# EAGLE design HW2schematic (EAGLE 8.1.0)
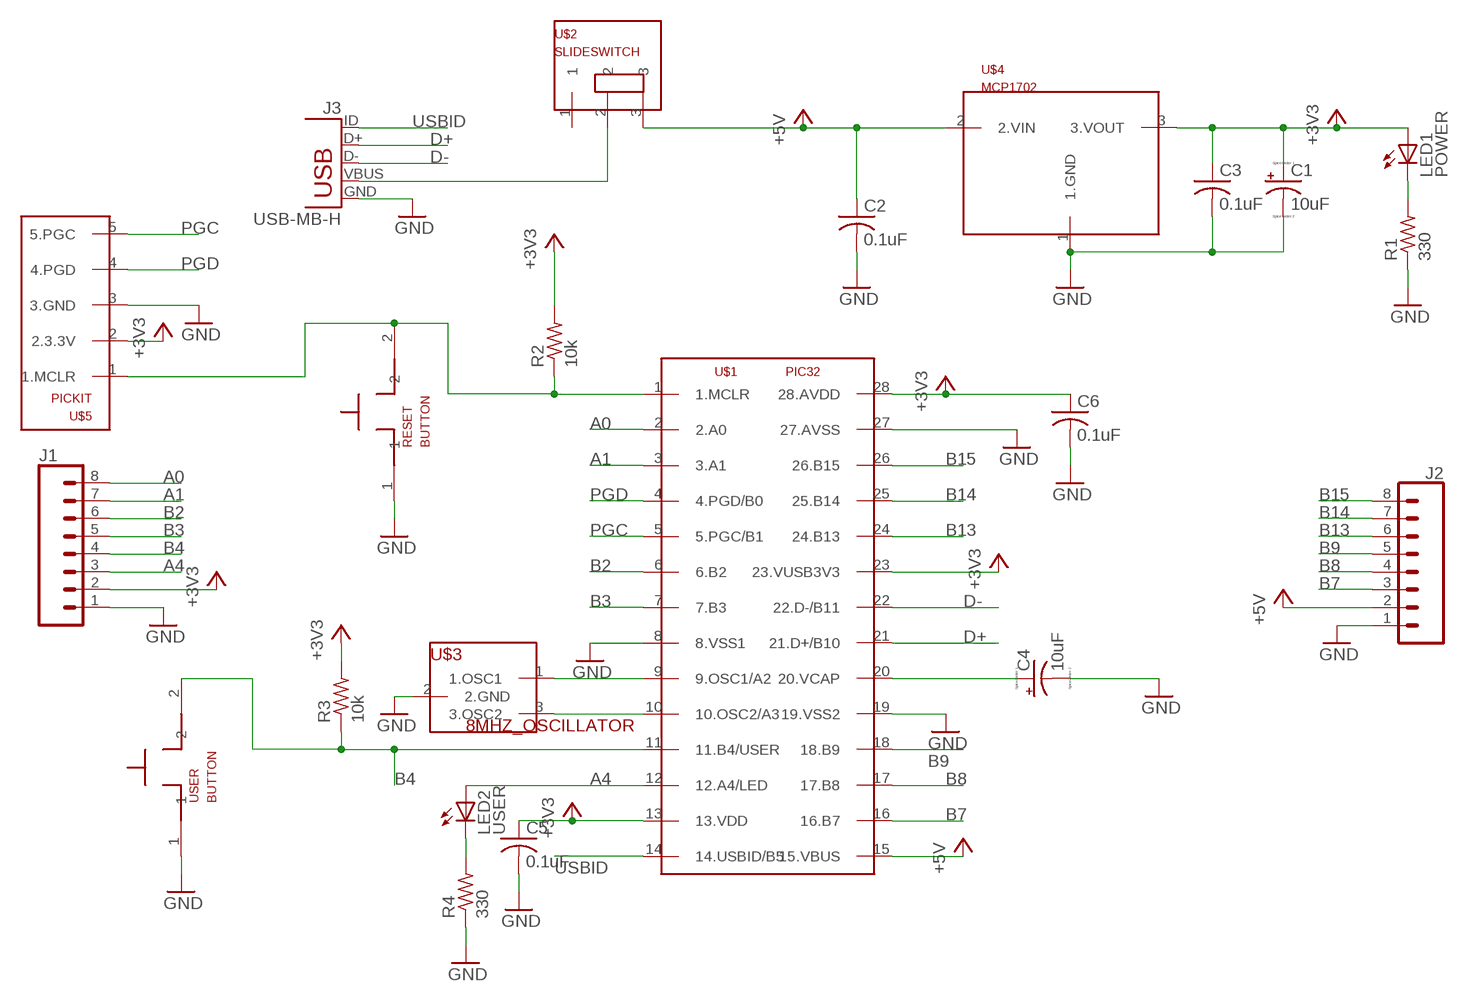
[diagram p0: schematic, sheet 1]

## Parts
C1  10uF  CPOL-USB45181B  [B45181B]
C2  0.1uF  C-US025-025X050  [C025-025X050]
C3  0.1uF  C-US025-025X050  [C025-025X050]
C4  10uF  CPOL-USB45181B  [B45181B]
C5  0.1uF  C-US025-025X050  [C025-025X050]
C6  0.1uF  C-US025-025X050  [C025-025X050]
J1  CONN_08  [1X08_NO_SILK]
J2  CONN_08  [1X08_NO_SILK]
J3  USB-MB-H  [USB-MB-H]
LED1  POWER  LED3MM  [LED3MM]
LED2  USER  LED3MM  [LED3MM]
R1  330  R-US_0207/10  [0207/10]
R2  10k  R-US_0207/10  [0207/10]
R3  10k  R-US_0207/10  [0207/10]
R4  330  R-US_0207/10  [0207/10]
RESET  BUTTON  [BUTTON]
U$1  PIC32  [DIL28-3]
U$2  SLIDESWITCH  [SLIDESWITCH]
U$3  8MHZ_OSCILLATOR  8MHZ_RESONATOR  [1X03]
U$4  MCP1702  [TO92]
U$5  PICKIT  [PICKIT]
USER  BUTTON  [BUTTON]

## Nets
+3V3: C1.+ C3.1 C5.1 C6.1 J1.2 LED1.A R2.2 R3.2 U$1.13(13.VDD) U$1.23(23.VUSB3V3) U$1.28(28.AVDD) U$4.3(3.VOUT) U$5.2(2.3.3V)
+5V: C2.1 J2.2 U$1.15(15.VBUS) U$2.3 U$4.2(2.VIN)
A0: J1.8 U$1.2(2.A0)
A1: J1.7 U$1.3(3.A1)
A4: J1.3 LED2.A U$1.12(12.A4/LED)
B2: J1.6 U$1.6(6.B2)
B3: J1.5 U$1.7(7.B3)
B4: J1.4 R3.1 U$1.11(11.B4/USER) USER.2
B7: J2.3 U$1.16(16.B7)
B8: J2.4 U$1.17(17.B8)
B9: J2.5 U$1.18(18.B9)
B13: J2.6 U$1.24(24.B13)
B14: J2.7 U$1.25(25.B14)
B15: J2.8 U$1.26(26.B15)
D+: J3.D+ U$1.21(21.D+/B10)
D-: J3.D- U$1.22(22.D-/B11)
GND: C1.- C2.2 C3.2 C4.- C5.2 C6.2 J1.1 J2.1 J3.GND R1.1 R4.1 RESET.1 U$1.8(8.VSS1) U$1.19(19.VSS2) U$1.27(27.AVSS) U$3.2(2.GND) U$4.1(1.GND) U$5.3(3.GND) USER.1
N$1: LED2.K(C) R4.2
N$4: R2.1 RESET.2 U$1.1(1.MCLR) U$5.1(1.MCLR)
N$5: C4.+ U$1.20(20.VCAP)
N$6: J3.VBUS U$2.2
N$7: U$1.9(9.OSC1/A2) U$3.1(1.OSC1)
N$8: LED1.K(C) R1.2
N$9: U$1.10(10.OSC2/A3) U$3.3(3.OSC2)
PGC: U$1.5(5.PGC/B1) U$5.5(5.PGC)
PGD: U$1.4(4.PGD/B0) U$5.4(4.PGD)
USBID: J3.ID(D+1) U$1.14(14.USBID/B5)
Unconnected: U$2.1

## Library data of the parts
C1 C4 = HW2library:CPOL-US: POLARIZED CAPACITOR, American symbol
C2 C3 C5 C6 = HW2library:C-US: CAPACITOR, American symbol
J1 J2 = HW2library:CONN_08: Multi connection point. Often used as Generic Header-pin footprint for 0.1 inch spaced/style header connections On any of the 0.1 inch spaced packages, you can populate with these: Break Away Headers - Straight <https://www.sparkfun.com/products/116> (PRT-00116) Break Away Male Headers - Right Angle <https://www.sparkfun.com/products/553> (PRT-00553) Female Headers <https://www.sparkfun.com/products/115> (PRT-00115) Break Away Headers - Machine Pin <https://www.sparkfun.com/products/117> (PRT-00117) Break Away Female Headers - Swiss Machine Pin <https://www.sparkfun.com/products/743> (PRT-00743) Arduino Stackable Header - 8 Pin <https://www.sparkfun.com/products/9279> (PRT-09279) For SCREWTERMINALS and SPRING TERMINALS visit here: Screw Terimnals on SparkFun.com <https://www.sparkfun.com/search/results?term=Screw+Terminals> (5mm/3.5mm/2.54mm spacing) This device is also useful as a general connection point to wire up your design to another part of your project. Our various solder wires solder well into these plated through hole pads. Hook-Up Wire - Assortment (Stranded, 22 AWG) <https://www.sparkfun.com/products/11375> (PRT-11375) Hook-Up Wire - Assortment (Solid Core, 22 AWG) <https://www.sparkfun.com/products/11367> (PRT-11367) View the entire wire category on our website here <https://www.sparkfun.com/categories/141> Special notes: Molex polarized connector foot print use with SKU : PRT-08231 with associated crimp pins and housings. 1MM SMD Version SKU: PRT-10208 NOTES ON THE VARIANTS LOCK and LOCK_LONGPADS... This footprint was designed to help hold the alignment of a through-hole component (i.e. 6-pin header) while soldering it into place. You may notice that each hole has been shifted either up or down by 0.005 of an inch from it's more standard position (which is a perfectly straight line). This slight alteration caused the pins (the squares in the middle) to touch the edges of the holes. Because they are alternating, it causes a "brace" to hold the component in place. 0.005 has proven to be the perfect amount of "off-center" position when using our standard breakaway headers. Although looks a little odd when you look at the bare footprint, once you have a header in there, the alteration is very hard to notice. Also,if you push a header all the way into place, it is covered up entirely on the bottom side.
J3 = HW2library:USB: USB Connectors USB-B-PTH is fully proven SKU : PRT-00139/CONN-08278 USB-miniB is fully proven SKU : PRT-00587 USB-A-PCB is untested. USB-A-H is throughly reviewed, but untested. Spark Fun Electronics SKU : PRT-00437 USB-B-SMT is throughly reviewed, but untested. Needs silkscreen touching up. USB-A-S has not been used/tested USB-MB-H has not been used/tested USB-MICROB has been used. CONN-09505
LED1 LED2 = HW2library:LED: LED OSRAM: - CHIPLED LG R971, LG N971, LY N971, LG Q971, LY Q971, LO R971, LY R971 LH N974, LH R974 LS Q976, LO Q976, LY Q976 LO Q996 - Hyper CHIPLED LW Q18S LB Q993, LB Q99A, LB R99A - SideLED LS A670, LO A670, LY A670, LG A670, LP A670 LB A673, LV A673, LT A673, LW A673 LH A674 LY A675 LS A676, LA A676, LO A676, LY A676, LW A676 LS A679, LY A679, LG A679 - Hyper Micro SIDELED® LS Y876, LA Y876, LO Y876, LY Y876 LT Y87S - SmartLED LW L88C, LW L88S LB L89C, LB L89S, LG L890 LS L89K, LO L89K, LY L89K LS L896, LA L896, LO L896, LY L896 - TOPLED LS T670, LO T670, LY T670, LG T670, LP T670 LSG T670, LSP T670, LSY T670, LOP T670, LYG T670 LG T671, LOG T671, LSG T671 LB T673, LV T673, LT T673, LW T673 LH T674 LS T676, LA T676, LO T676, LY T676, LB T676, LH T676, LSB T676, LW T676 LB T67C, LV T67C, LT T67C, LS T67K, LO T67K, LY T67K, LW E67C LS E67B, LA E67B, LO E67B, LY E67B, LB E67C, LV E67C, LT E67C LW T67C LS T679, LY T679, LG T679 LS T770, LO T770, LY T770, LG T770, LP T770 LB T773, LV T773, LT T773, LW T773 LH T774 LS E675, LA E675, LY E675, LS T675 LS T776, LA T776, LO T776, LY T776, LB T776 LHGB T686 LT T68C, LB T68C - Hyper Mini TOPLED® LB M676 - Mini TOPLED Santana® LG M470 LS M47K, LO M47K, LY M47K Source: http://www.osram.convergy.de LUXEON: - LUMILED® LXK2-PW12-R00, LXK2-PW12-S00, LXK2-PW14-U00, LXK2-PW14-V00 LXK2-PM12-R00, LXK2-PM12-S00, LXK2-PM14-U00 LXK2-PE12-Q00, LXK2-PE12-R00, LXK2-PE12-S00, LXK2-PE14-T00, LXK2-PE14-U00 LXK2-PB12-K00, LXK2-PB12-L00, LXK2-PB12-M00, LXK2-PB14-N00, LXK2-PB14-P00, LXK2-PB14-Q00 LXK2-PR12-L00, LXK2-PR12-M00, LXK2-PR14-Q00, LXK2-PR14-R00 LXK2-PD12-Q00, LXK2-PD12-R00, LXK2-PD12-S00 LXK2-PH12-R00, LXK2-PH12-S00 LXK2-PL12-P00, LXK2-PL12-Q00, LXK2-PL12-R00 Source: www.luxeon.com KINGBRIGHT: KA-3528ASYC Source: www.kingbright.com
R1-R4 = HW2library:R-US_: RESISTOR, American symbol
RESET USER = HW2library:BUTTON
U$1 = HW2library:PIC32
U$2 = HW2library:SLIDESWITCH
U$3 = HW2library:8MHZ_RESONATOR
U$4 = HW2library:MCP1702
U$5 = HW2library:PICKIT

## Board
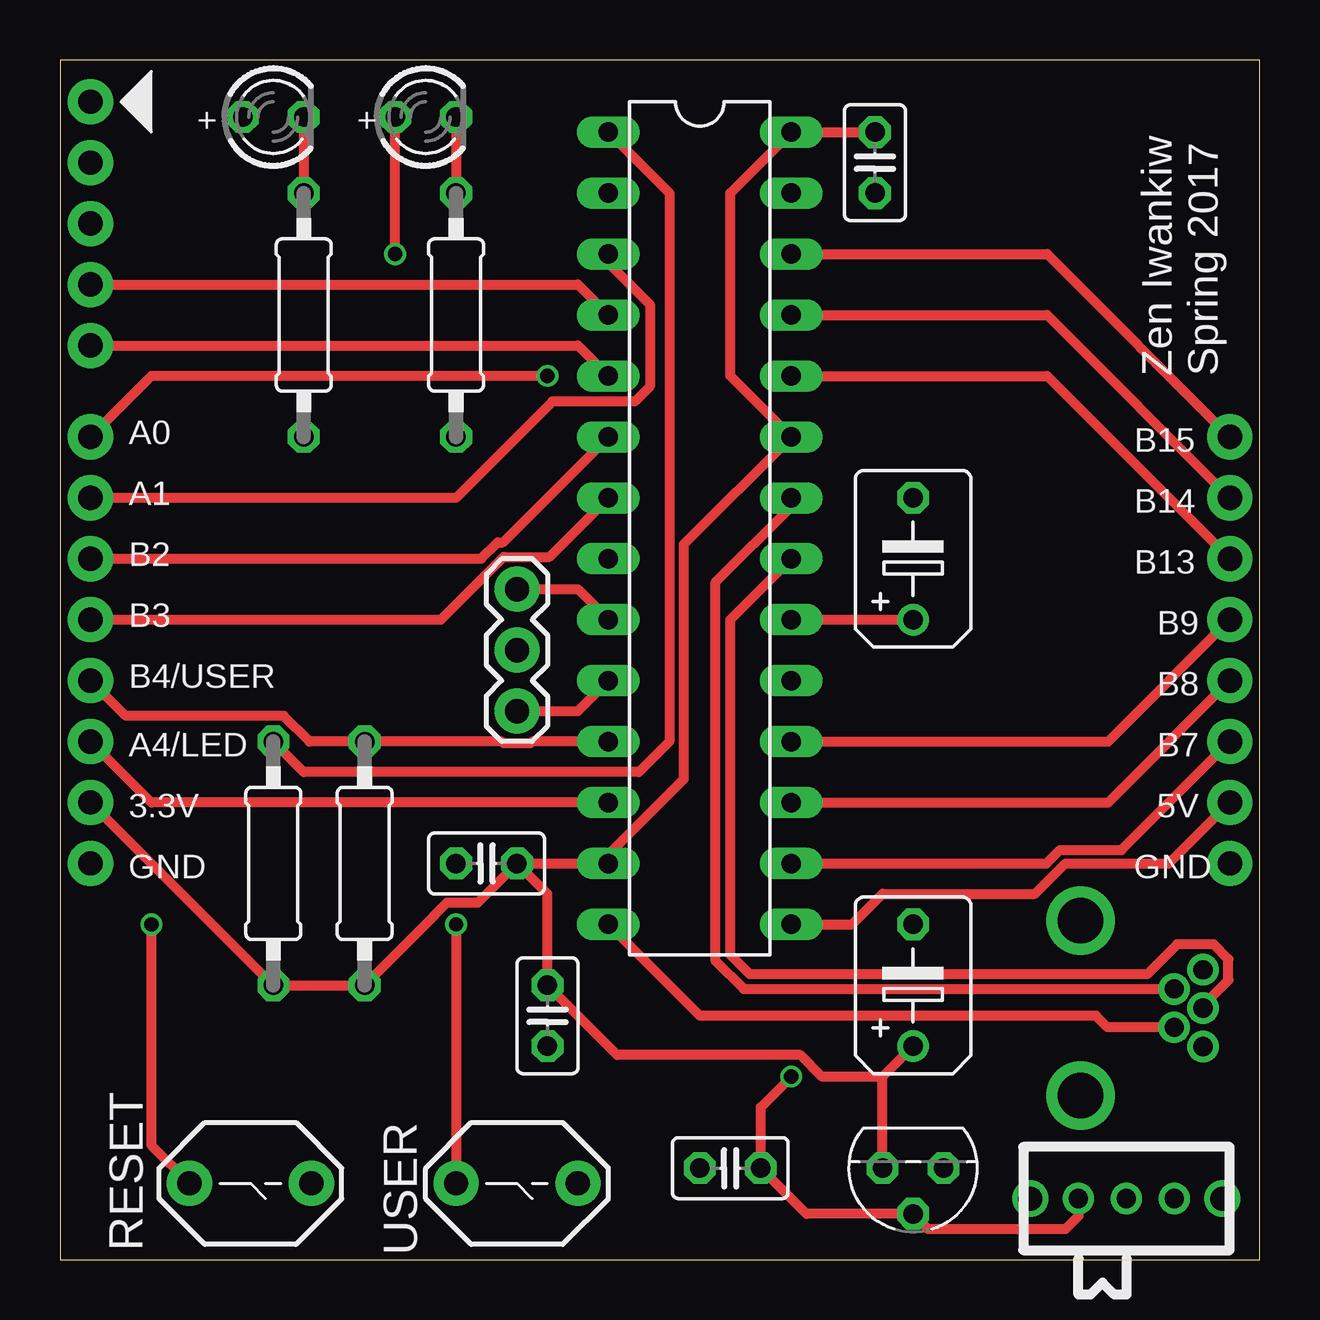
[diagram p1: board, top side]
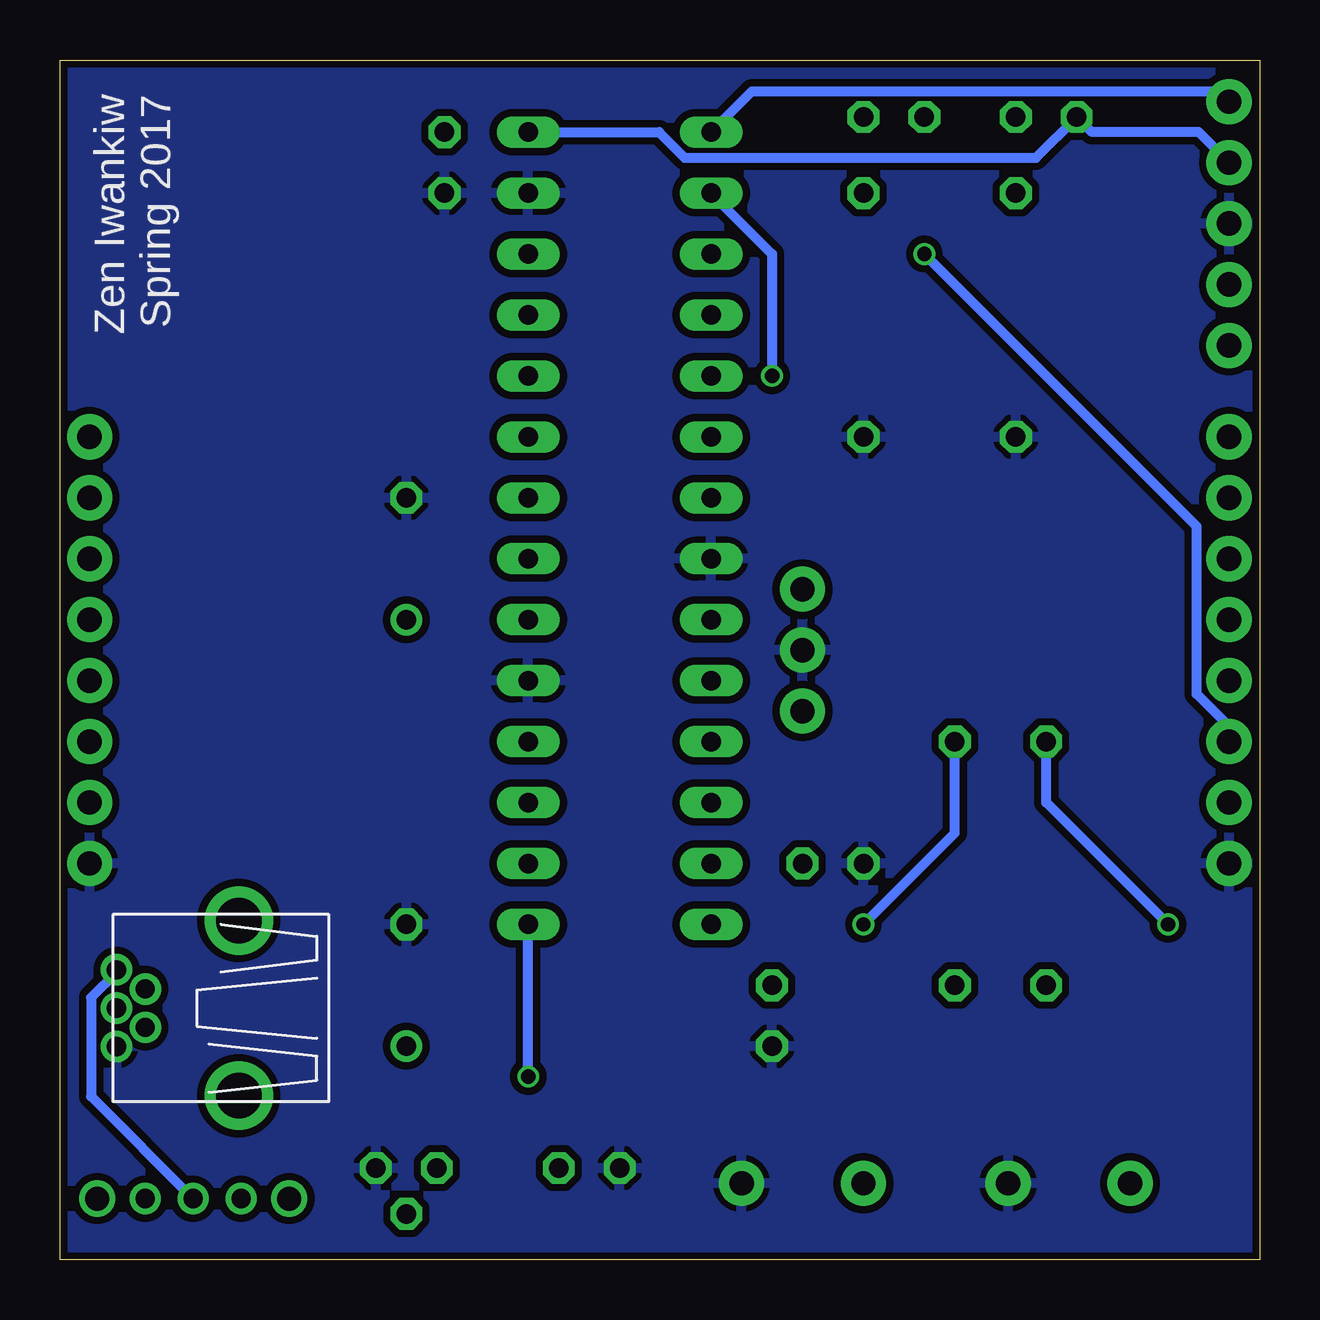
[diagram p2: board, bottom side, seen from below]

Size 50 x 50 mm. Coordinates in mm from the lower left corner, seen from the top.
Outline: 0,0 50,0 50,50 0,50 0,0
Copper layers (1*16): Top 0.035mm / dielectric 1.5mm / Bottom 0.035mm
Design rules "SeeedStudio_2layer_DRU_no_angle_20140221": minimum track width 6mil, minimum drill 12mil, track to track 6mil, track to pad 6mil, pad to pad 6mil, via to via 6mil, smd to smd 0mil, copper to edge 10mil, drill to drill 10mil, minimum pad ring 10mil, minimum via ring 6mil, stop-mask expansion 2mil, vias tented up to drill 100mil, thermal gap 10mil

### Footprints (pad centres in the part's own frame; a part is rotated, then mirrored left to right if it is on the bottom)
B45181B = drill 0.813: + -2.54,0 | drill 0.813 octagon: - 2.54,0
C025-025X050 = drill 0.813 octagon: 1 -1.27,0; 2 1.27,0
1X08_NO_SILK = drill 1.016 pad 1.88: 1 0,0; 2 2.54,0; 3 5.08,0; 4 7.62,0; 5 10.16,0; 6 12.7,0; 7 15.24,0; 8 17.78,0
USB-MB-H = drill 0.8: D+ 5.1,0; D- 3.9,0.8; GND 5.1,-1.6; ID 3.9,-0.8; VBUS 5.1,1.6 | drill 1.9: P$6 0,-3.65; P$7 0,3.65
LED3MM = drill 0.813 octagon: A -1.27,0; K 1.27,0
0207/10 = drill 0.813 octagon: 1 -5.08,0; 2 5.08,0
BUTTON = drill 1.016 pad 1.88: 1 -2.54,0; 2 2.54,0
DIL28-3 = drill 0.813 long: 1 -16.51,-3.81; 2 -13.97,-3.81; 3 -11.43,-3.81; 4 -8.89,-3.81; 5 -6.35,-3.81; 6 -3.81,-3.81; 7 -1.27,-3.81; 8 1.27,-3.81; 9 3.81,-3.81; 10 6.35,-3.81; 11 8.89,-3.81; 12 11.43,-3.81; 13 13.97,-3.81; 14 16.51,-3.81; 15 16.51,3.81; 16 13.97,3.81; 17 11.43,3.81; 18 8.89,3.81; 19 6.35,3.81; 20 3.81,3.81; 21 1.27,3.81; 22 -1.27,3.81; 23 -3.81,3.81; 24 -6.35,3.81; 25 -8.89,3.81; 26 -11.43,3.81; 27 -13.97,3.81; 28 -16.51,3.81
SLIDESWITCH = drill 0.8: 1 -2,0; 2 0,0; 3 2,0 | drill 1: P$1 -4,0; P$2 4,0
1X03 = drill 1.016 pad 1.88: 1 0,0; 2 2.54,0; 3 5.08,0
TO92 = drill 0.813 octagon: 1 -1.27,0; 2 0,1.905; 3 1.27,0
PICKIT = drill 1.016 pad 1.88: 1 -5.08,0; 2 -2.54,0; 3 0,0; 4 2.54,0; 5 5.08,0

### Placement (x,y rotation side)
C1  35.56,11.43 90 top
C2  27.94,3.81 180 top
C3  20.32,10.16 270 top
C4  35.56,29.21 90 top
C5  17.78,16.51 180 top
C6  33.97,45.72 270 top
J1  1.27,16.51 90 top
J2  48.77,16.51 90 top
J3  42.55,10.48 0 top
LED1  8.89,47.62 0 top
LED2  15.24,47.62 0 top
R1  10.16,39.37 90 top
R2  8.89,16.51 270 top
R3  12.7,16.51 270 top
R4  16.51,39.37 90 top
RESET  7.94,3.17 180 top
U$1  26.67,30.48 270 top
U$2  44.45,2.54 180 top
U$3  19.05,27.94 270 top
U$4  35.56,3.81 180 top
U$5  1.27,43.18 270 top
USER  19.05,3.17 180 top

### Tracks (layer width: path | path; a pad name or v marks a point on that pad's centre or on a via)
+3V3
  Top 0.406: C6.1 U$1.28 27.94,44.45 27.94,36.83 U$1.23 26.01,29.82 26.01,20.03 22.86,16.88 U$1.13 C5.1 | U$4.3 34.29,7.62 | 34.29,7.62 C1.+ | 34.29,7.62 31.77,7.62 30.86,8.53 23.22,8.53 C3.1 20.32,15.24 C5.1 | J1.2 R2.2 R3.2 15.6,14.33 15.6,14.35 16.13,14.88 17.42,14.88 C5.1
  Bottom 0.406: U$5.2 2.54,46.99 6.99,46.99 LED1.A 9.32,45.92 23.96,45.92 25.03,46.99 U$1.28
+5V  (via drill 0.6)
  Top 0.406: U$2.3 42.45,1.81 41.91,1.27 36.2,1.27 U$4.2 31.11,1.91 C2.1 29.21,6.35 v30.48,7.62 | U$1.15 33.02,13.97 34.29,15.24 40.64,15.24 41.91,16.51 46.23,16.51 J2.2
  Bottom 0.406: v30.48,7.62 U$1.15
A0  (via drill 0.6)
  Top 0.406: v20.32,36.83 3.81,36.83 J1.8
  Bottom 0.406: U$1.2 20.32,41.91 v20.32,36.83
A1
  Top 0.406: U$1.3 22.86,41.54 24.59,39.81 24.59,36.39 23.96,35.76 20.52,35.76 16.51,31.75 J1.7
A4  (via drill 0.6)
  Top 0.406: U$1.12 3.81,19.05 J1.3 | v13.97,41.91 LED2.A
  Bottom 0.406: 1.27,22.23 J1.3 1.27,22.23 | v13.97,41.91 2.62,30.56 2.62,23.57 1.27,22.23
B2
  Top 0.406: J1.6 17.55,29.21 18.24,29.9 18.47,29.9 U$1.6
B3
  Top 0.406: U$1.7 20.4,29.29 18.49,29.29 15.88,26.67 J1.5
B4  (via drill 0.6)
  Top 0.406: U$1.11 19.68,21.59 19.61,21.51 18.49,21.51 18.42,21.59 R3.1 10.4,21.59 9.33,22.66 2.74,22.66 J1.4 | v16.51,13.97 USER.2
  Bottom 0.406: v16.51,13.97 12.7,17.78 R3.1
B7
  Top 0.406: U$1.16 41.12,16.51 41.68,17.07 44.25,17.07 J2.3
B8
  Top 0.406: U$1.17 43.69,19.05 J2.4
B9
  Top 0.406: U$1.18 43.69,21.59 J2.5
B13
  Top 0.406: U$1.24 41.15,36.83 J2.6
B14
  Top 0.406: U$1.25 41.15,39.37 J2.7
B15
  Top 0.406: U$1.26 41.15,41.91 J2.8
D+
  Top 0.406: J3.D+ 47.65,10.58 48.7,11.64 48.7,12.52 48.08,13.14 46.57,13.14 45.31,11.89 28.75,11.89 27.94,12.7 27.94,26.67 U$1.21
D-
  Top 0.406: U$1.22 30.48,31.38 27.33,28.23 27.33,12.45 28.5,11.28 J3.D-
GND
  pour Bottom (isolate 0.305): 0,50.8 52.07,50.8 52.07,-1.27 -1.27,-1.27 -1.27,50.8
N$1
  Top 0.406: LED2.K R4.2
N$4  (via drill 0.6)
  Top 0.406: U$1.1 25.4,44.45 25.4,21.59 24.13,20.32 10.16,20.32 R2.1 | v3.81,13.97 3.81,4.76 RESET.2
  Bottom 0.406: U$1.1 21.16,48.69 1.7,48.69 U$5.1 | v3.81,13.97 8.89,19.05 R2.1
N$5
  Top 0.406: U$1.20 C4.+
N$6
  Bottom 0.406: J3.VBUS 47.65,11.98 48.7,10.92 48.7,6.79 U$2.2
N$7
  Top 0.406: U$3.1 21.59,27.94 U$1.9
N$8
  Top 0.406: LED1.K R1.2
N$9
  Top 0.406: U$3.3 21.59,22.86 U$1.10
PGC
  Top 0.406: U$5.5 21.59,38.1 U$1.5
PGD
  Top 0.406: U$5.4 21.59,40.64 U$1.4
USBID
  Top 0.406: J3.ID 43.66,9.68 43.18,10.16 26.67,10.16 U$1.14

### Text on the board
tPlace: + | + | Zen Iwankiw / Spring 2017 | A0 | B15 | A1 | B14 | B2 | B13 | B3 | B9 | B4/USER | B8 | A4/LED | B7 | 3.3V | 5V | GND | GND
bPlace: Zen Iwankiw / Spring 2017